# Altium schematic sheet I2C_GPIO_EXPANDER.SchDoc
size A4; SheetNumber: 2; SheetTotal: 6
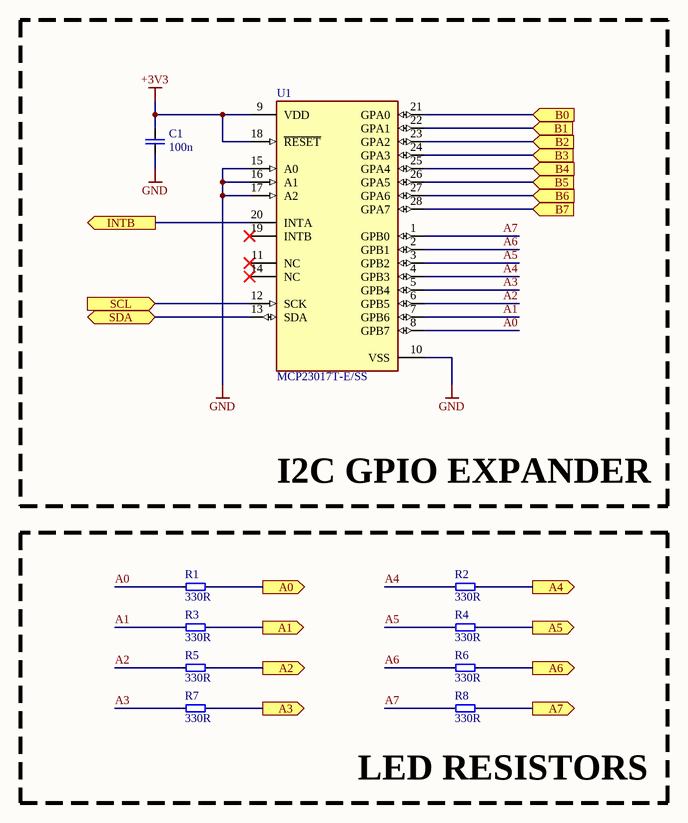
[diagram p0: I2C_GPIO_EXPANDER.SchDoc]

## Parts
C1  100n  [C0603]
R1  330R  [R0603]
R2  330R  [R0603]
R3  330R  [R0603]
R4  330R  [R0603]
R5  330R  [R0603]
R6  330R  [R0603]
R7  330R  [R0603]
R8  330R  [R0603]
U1  MCP23017T-E/SS  [FP-C04-073-IPC_C]

## Blocks framed on the sheet
I2C GPIO EXPANDER: C1 U1
LED RESISTORS: R1-R8

## Ports
A0 (out, see MED_BOX[3B]), A1 (out, see MED_BOX[3B]), A2 (out, see MED_BOX[3B]), A3 (out, see MED_BOX[3B]), A4 (out, see MED_BOX[3B]), A5 (out, see MED_BOX[3B]), A6 (out, see MED_BOX[3B]), A7 (out, see MED_BOX[3B]), B0 (in, see MED_BOX[3B]), B1 (in, see MED_BOX[3B]), B2 (in, see MED_BOX[3B]), B3 (in, see MED_BOX[3A]), B4 (in, see MED_BOX[3A]), B5 (in, see MED_BOX[3A]), B6 (in, see MED_BOX[3A]), B7 (in, see MED_BOX[3A]), INTB (out, see MED_BOX[3B], MCU[1B]), SCL (in, see MED_BOX[3B], MCU[2B], RTC[1A]), SDA (bidir, see MED_BOX[3B], MCU[2B], RTC[1A])

## Nets
+3V3: C1.2 U1.9(VDD) U1.18(~{RESET})
GND: C1.1 U1.10(VSS) U1.15(A0) U1.16(A1) U1.17(A2)
A0: R1.1 U1.8(GPB7)
A0: R1.2 ; port A0  [a separate net that carries the same name]
A1: R3.1 U1.7(GPB6)
A1: R3.2 ; port A1  [a separate net that carries the same name]
A2: R5.1 U1.6(GPB5)
A2: R5.2 ; port A2  [a separate net that carries the same name]
A3: R7.1 U1.5(GPB4)
A3: R7.2 ; port A3  [a separate net that carries the same name]
A4: R2.1 U1.4(GPB3)
A4: R2.2 ; port A4  [a separate net that carries the same name]
A5: R4.1 U1.3(GPB2)
A5: R4.2 ; port A5  [a separate net that carries the same name]
A6: R6.1 U1.2(GPB1)
A6: R6.2 ; port A6  [a separate net that carries the same name]
A7: R8.1 U1.1(GPB0)
A7: R8.2 ; port A7  [a separate net that carries the same name]
B0: U1.21(GPA0) ; port B0
B1: U1.22(GPA1) ; port B1
B2: U1.23(GPA2) ; port B2
B3: U1.24(GPA3) ; port B3
B4: U1.25(GPA4) ; port B4
B5: U1.26(GPA5) ; port B5
B6: U1.27(GPA6) ; port B6
B7: U1.28(GPA7) ; port B7
INTB: U1.20(INTA) ; port INTB
SCL: U1.12(SCK) ; port SCL
SDA: U1.13(SDA) ; port SDA

Not connected (* = marked no-connect by the designer): U1 11(NC)* 14(NC)* 19(INTB)*

## Library data of the parts
C1 = CMP-00024-8: Generic 0603 SMD Ceramic Capacitor
R1-R8 = CMP-00017-10: Generic 0603 SMD Resistor
U1 = CMP-0186-00065-3: IC I/O EXPANDER 16BIT I2C 28SSOP; Number of Channels: 1; Number of Bits: 16; Output Current: 25mA; Nominal Supply Current: 1mA; Operating Supply Voltage: 5.5V; Power Dissipation: 700mW; Max Frequency: 10MHz; Frequency: 1.7MHz; Case/Package: SSOP; Lead Free: Lead Free; Number of Pins: 28; Interface: I2C; Max Operating Temperature: 125°C; Mount: Surface Mount; Number of I/Os: 16; Packaging: Tape and Reel; Min Operating Temperature: -40°C; Package Quantity: 2100